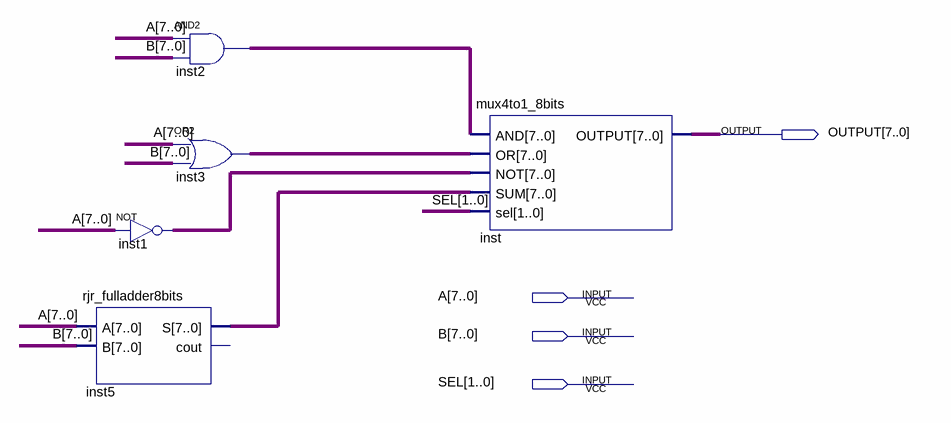
[diagram p0: schematic sheet]
// Quartus schematic ula4.bdf as structural Verilog: 5 symbols, 4 pins
module ula4 (
  input  [7:0] A,
  input  [7:0] B,
  input  [1:0] SEL,
  output [7:0] OUTPUT
);

  wire [7:0] inst1_out, inst2_out, inst3_out, inst5_s;

  assign inst1_out = ~A;  // NOT inst1, 8 bits wide
  rjr_fulladder8bits inst5 (.A(A), .B(B), .S(inst5_s));  // open: cout
  assign inst2_out = A & B;  // AND2 inst2, 8 bits wide
  assign inst3_out = A | B;  // OR2 inst3, 8 bits wide
  mux4to1_8bits inst (.AND(inst2_out), .OR(inst3_out), .NOT(inst1_out), .SUM(inst5_s), .sel(SEL), .OUTPUT(OUTPUT));
endmodule
